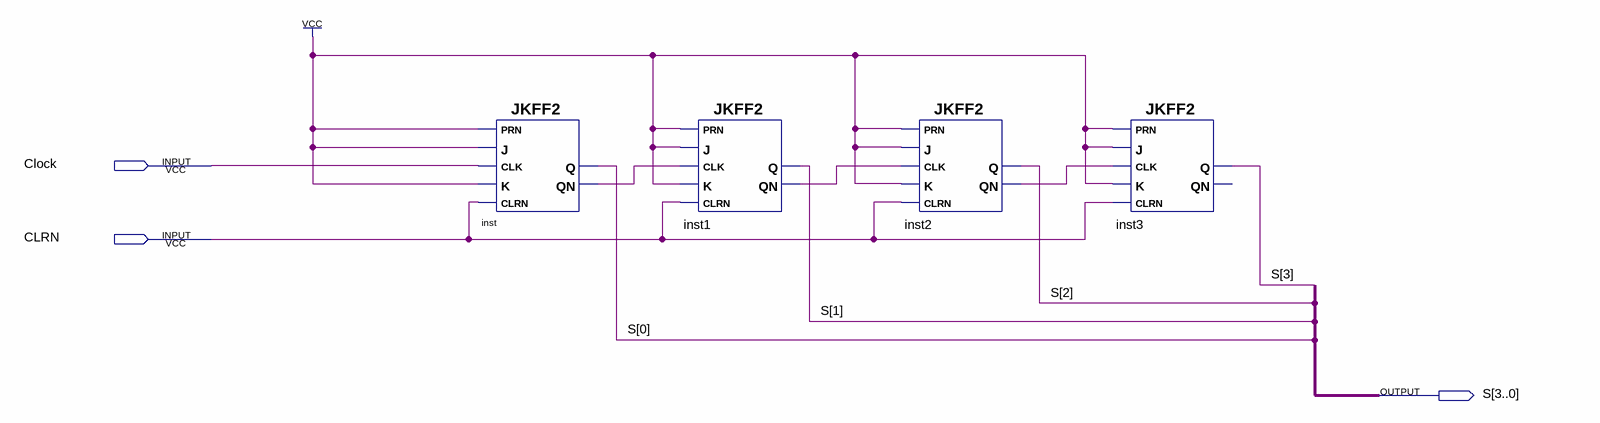
[diagram p0: schematic sheet]
// Quartus schematic counting.bdf as structural Verilog: 4 symbols, 3 pins
module counting (
  input  Clock,
  input  CLRN,
  output [3:0] S
);

  wire inst1_qn, inst2_qn, inst_qn;

  JKFF2 inst (.K(1'b1), .CLRN(CLRN), .CLK(Clock), .PRN(1'b1), .J(1'b1), .QN(inst_qn), .Q(S[0]));
  JKFF2 inst1 (.K(1'b1), .CLRN(CLRN), .CLK(inst_qn), .PRN(1'b1), .J(1'b1), .QN(inst1_qn), .Q(S[1]));
  JKFF2 inst2 (.K(1'b1), .CLRN(CLRN), .CLK(inst1_qn), .PRN(1'b1), .J(1'b1), .QN(inst2_qn), .Q(S[2]));
  JKFF2 inst3 (.K(1'b1), .CLRN(CLRN), .CLK(inst2_qn), .PRN(1'b1), .J(1'b1), .Q(S[3]));  // open: QN
endmodule
